# EAGLE design USB Injector (EAGLE 6.2)
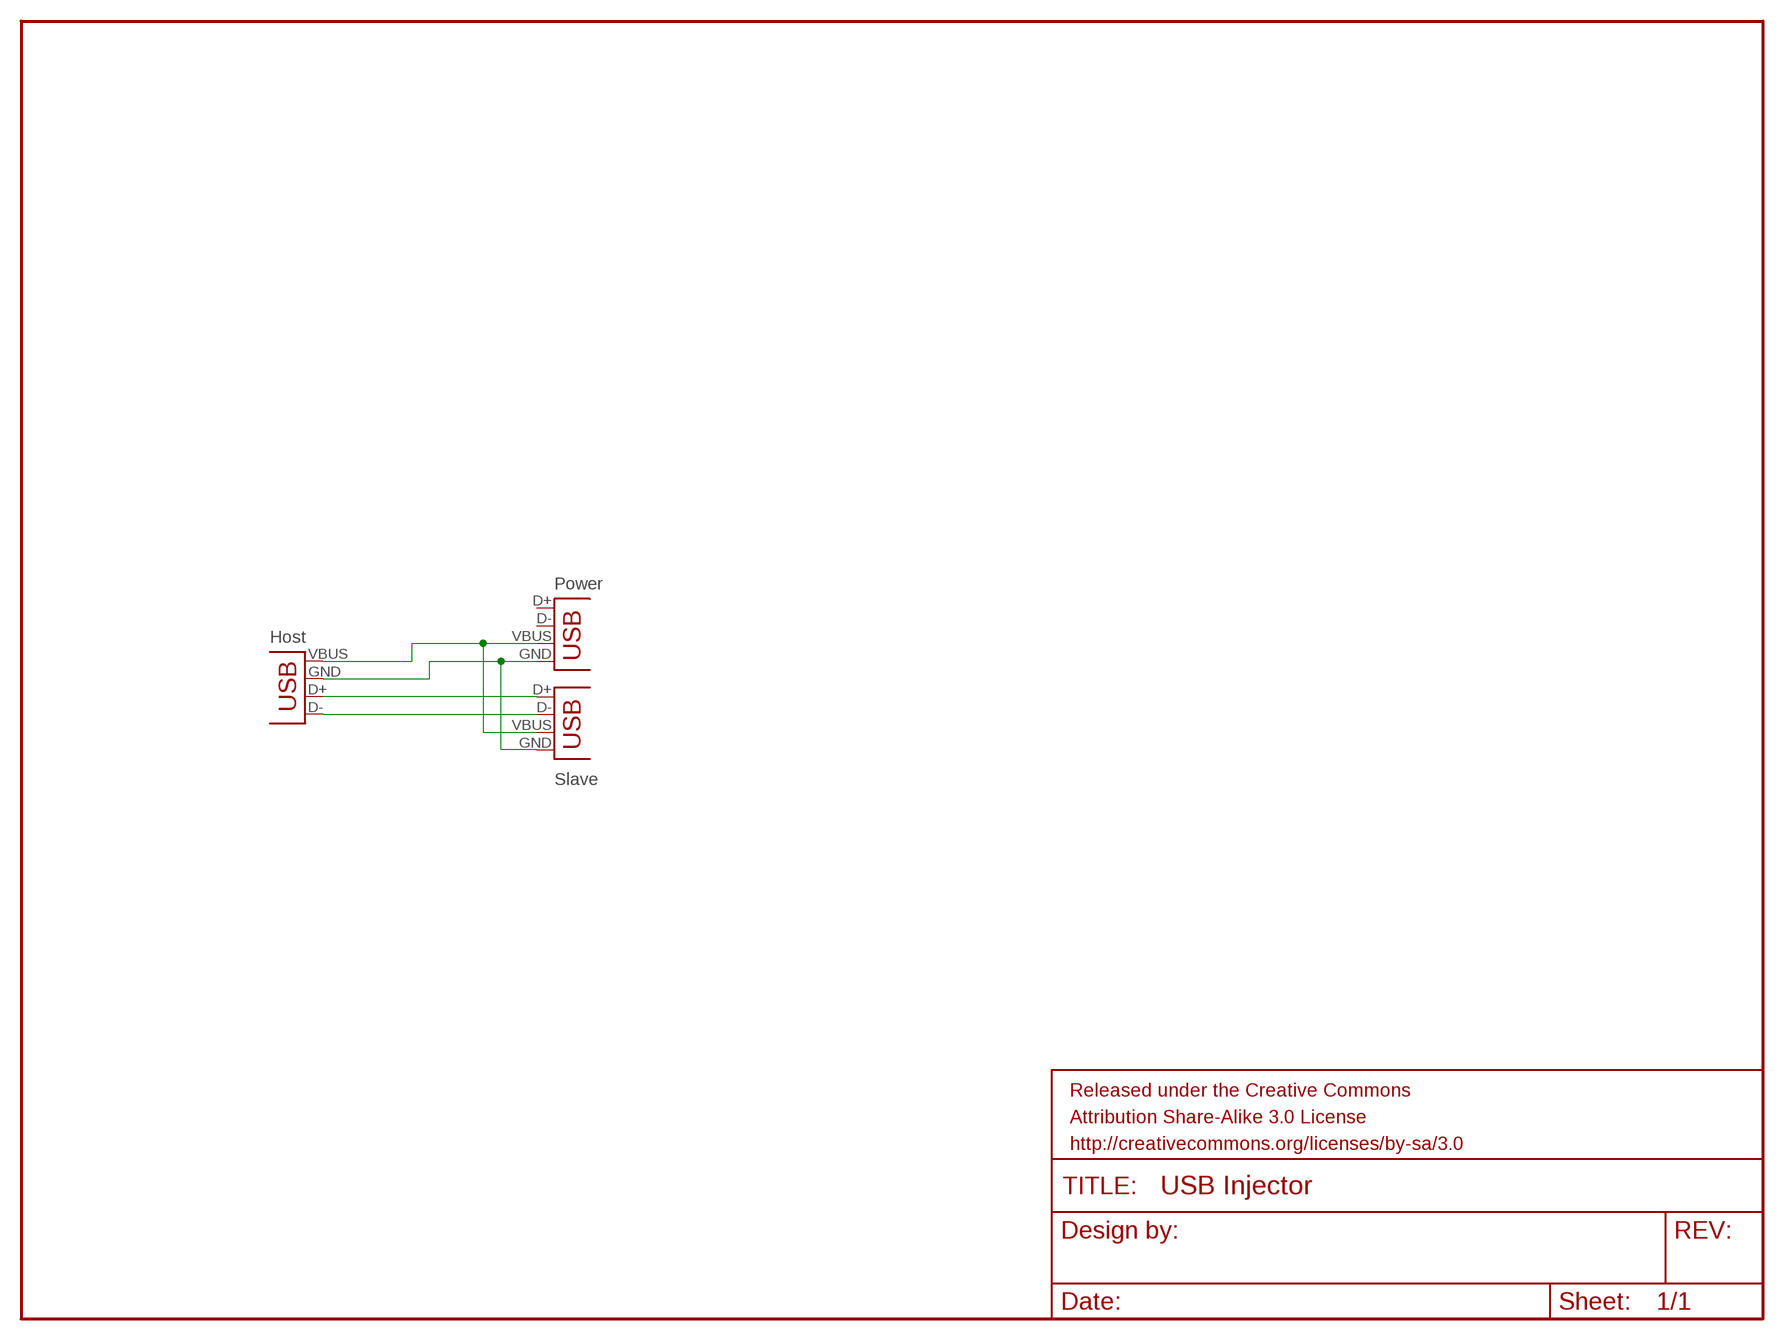
[diagram p0: schematic, sheet 1]

## Parts
X1  USB-A-SMD  [USB-A-S-NOSILK-FEMALE]
X2  USB-A-H  [USB-A-H]
X3  USBSMD  [USB-MINIB]

## Nets
GND: X1.GND X2.GND(VBUS) X3.GND
N$1: X1.D- X2.D-(D+)
N$2: X1.D+ X2.D+(D-)
VDD: X1.VBUS X2.VBUS(GND) X3.VBUS
Unconnected: X3.D+ X3.D-

## Notes on the sheet
- Power
- Host
- Slave

## Library data of the parts
X1-X3 = SparkFun-Connectors:USB: USB Connectors USB-B-PTH is fully proven SKU : PRT-00139 USB-miniB is fully proven SKU : PRT-00587 USB-A-PCB is untested. USB-A-H is throughly reviewed, but untested. Spark Fun Electronics SKU : PRT-00437 USB-B-SMT is throughly reviewed, but untested. Needs silkscreen touching up. USB-A-S has not been used/tested USB-MB-H has not been used/tested

## Board
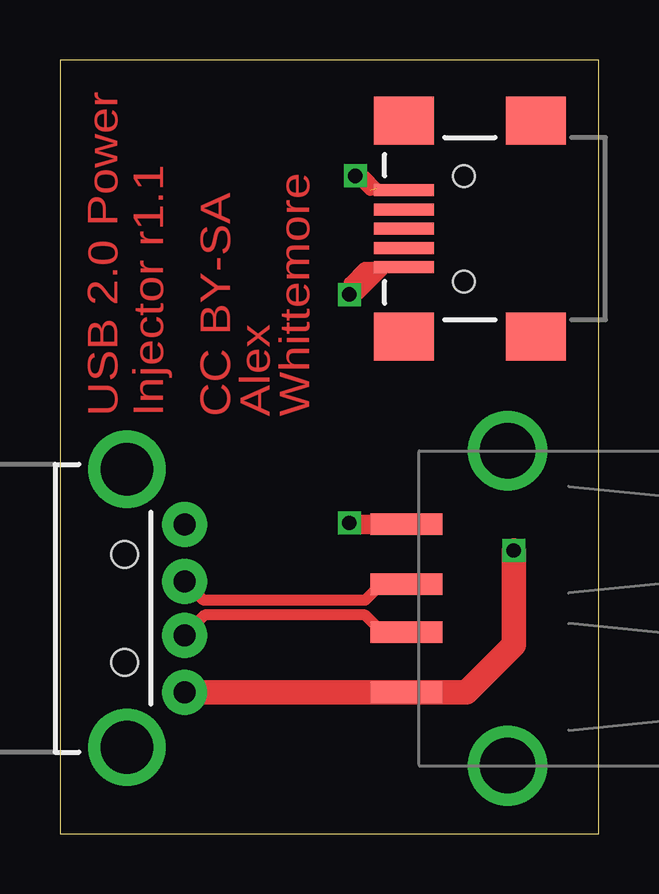
[diagram p1: board, top side]
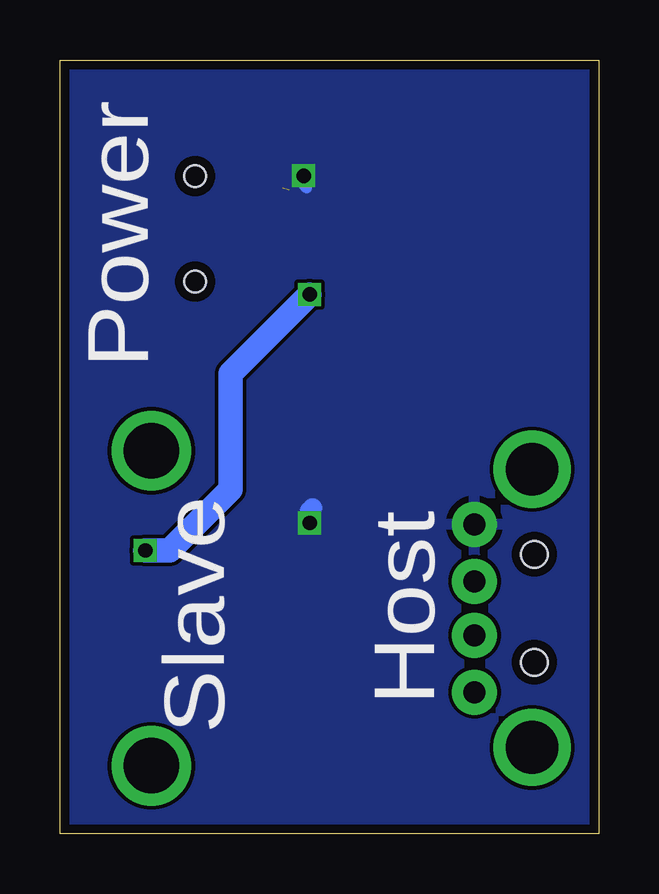
[diagram p2: board, bottom side, seen from below]

Size 22.48 x 32.26 mm. Coordinates in mm from the lower left corner, seen from the top.
Outline: 0,0 22.46,0 22.48,32.26 0,32.26 0,0
Copper layers (1*16): Top 0.0356mm / dielectric 1.5011mm / Bottom 0.0356mm
Design rules: minimum track width 6mil, minimum drill 13mil, track to track 6mil, track to pad 6mil, pad to pad 6mil, via to via 6mil, smd to smd 6mil, copper to edge 15mil, drill to drill 6mil, minimum pad ring 7mil, minimum via ring 7mil, stop-mask expansion 4mil, vias tented up to drill 40mil, thermal gap 10mil

### Footprints (pad centres in the part's own frame; a part is rotated, then mirrored left to right if it is on the bottom)
USB-A-S-NOSILK-FEMALE = smd 3 x 0.9: D+ 4.212,-1; D- 4.212,1; GND 4.212,-3.5; VBUS 4.212,3.5 | drill 2.311: P$5 0,-6.566; P$6 0,6.566
USB-A-H = drill 0.914 pad 1.88: D+ 2.4,1.127; D- 2.4,-1.127; GND 2.4,3.5; VBUS 2.4,-3.5 | drill 2.2: GND2 0,-5.8; GND3 0,5.8 | hole 1.1: -0.1,2.25; -0.1,-2.25
USB-MINIB = smd 2.5 x 0.5: D+ 2.5,0; D- 2.5,0.8; GND 2.5,-1.6; ID 2.5,-0.8; VBUS 2.5,1.6 | smd 2.5 x 2: MTN1 -3,4.5; MTN2 2.5,4.5; MTN3 -3,-4.5; MTN4 2.5,-4.5 | hole 0.9: 0,2.2; 0,-2.2

### Placement (x,y rotation side)
X1  18.67,9.4 180 top
X2  2.79,9.4 0 top
X3  16.84,25.22 180 top

### Tracks (layer width: path | path; a pad name or v marks a point on that pad's centre or on a via)
GND  (via drill 0.6)  (1 unrouted)
  Top 0.457: X3.GND 12.93,26.82 v12.32,27.43 | 12.7,27.43 13.21,26.92
  Top 0.813: X1.GND 12.12,12.9 v12.06,12.95
  Bottom 0.457: v12.32,27.43 12.32,27.05 12.19,26.92
  Bottom 0.813: v12.06,12.95 12.06,13.46 11.94,13.59
  pour Bottom: 0,32 0,0 22.48,0 22.48,32
N$1
  Top 0.254: 14.46,8.27 X1.D-
  Top 0.457: X1.D- 13.45,8.4 12.72,9.12 6.04,9.12 X2.D-
N$2
  Top 0.457: X1.D+ 13.39,10.4 12.72,9.73 5.99,9.73 X2.D+
VDD  (via drill 0.6)
  Top 0.457: v12.06,22.48 12.06,22.99 12.7,23.62 13.21,23.62 | 13.21,23.62 13.59,23.62 | 13.59,23.62 X3.VBUS | X3.VBUS | v12.06,22.48 13.21,23.62 | v12.06,22.48 12.45,22.48 13.59,23.62
  Top 1.016: X2.VBUS X1.VBUS 16.95,5.9 18.92,7.87 v18.92,11.81
  Bottom 1.016: v18.92,11.81 17.91,11.81 15.37,14.35 15.37,19.18 v12.06,22.48

### Text on the board
Top: USB 2.0 Power | Injector r1.1 | CC BY-SA | Alex | Whittemore
bPlace: Power | Host | Slave
tStop: USB 2.0 Power | Injector r1.1 | CC BY-SA | Alex | Whittemore